# Altium schematic sheet IFAT6.SchDoc: IFAT6 PCB
size C; Revision: 1.0
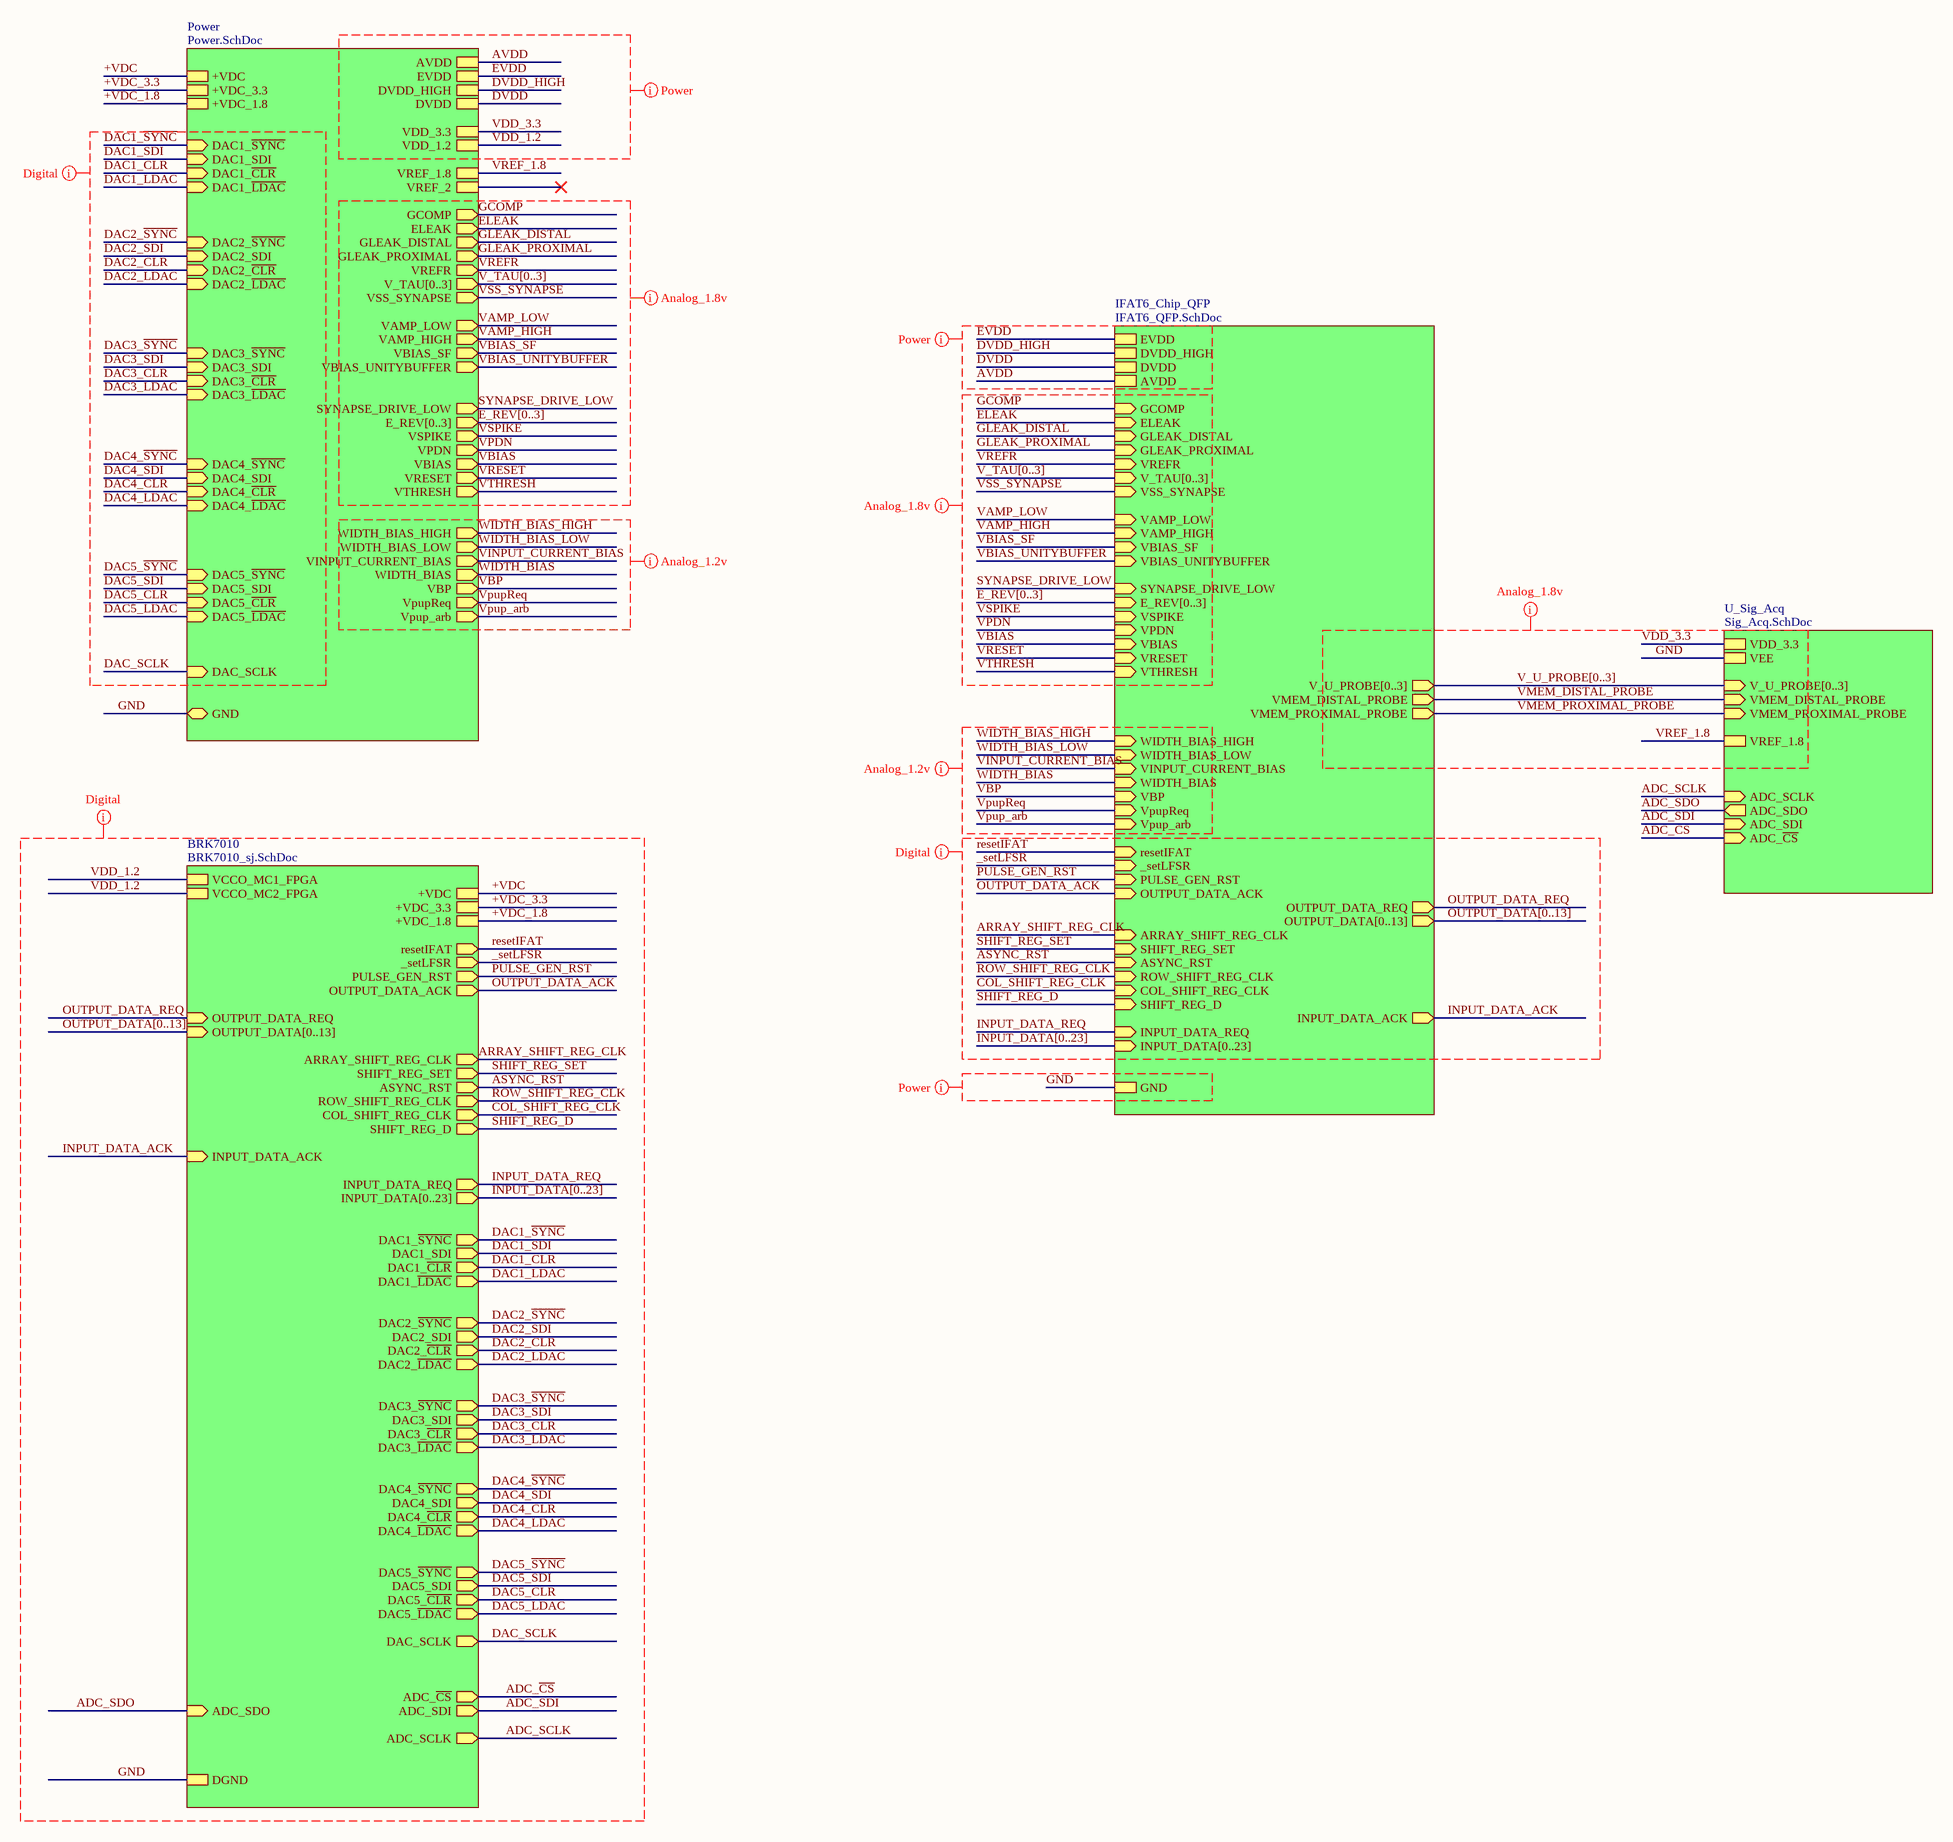
[diagram p0: IFAT6.SchDoc]

## Sub-sheets
BRK7010 = BRK7010_sj.SchDoc: VCCO_MC2_FPGA, DGND, +VDC, +VDC_3.3, INPUT_DATA[0..23] (out), OUTPUT_DATA[0..13] (in), resetIFAT (out), _setLFSR (out), PULSE_GEN_RST (out), OUTPUT_DATA_ACK (out), OUTPUT_DATA_REQ (in), ARRAY_SHIFT_REG_CLK (out), SHIFT_REG_SET (out), ASYNC_RST (out), ROW_SHIFT_REG_CLK (out), COL_SHIFT_REG_CLK (out), SHIFT_REG_D (out), INPUT_DATA_ACK (in), INPUT_DATA_REQ (out), +VDC_1.8, DAC1_~{SYNC} (out), DAC1_SDI (out), DAC1_~{CLR} (out), DAC1_~{LDAC} (out), DAC2_~{SYNC} (out), DAC2_SDI (out), DAC2_~{CLR} (out), DAC2_~{LDAC} (out), DAC3_~{SYNC} (out), DAC3_SDI (out), DAC3_~{CLR} (out), DAC3_~{LDAC} (out), DAC4_~{CLR} (out), DAC4_~{LDAC} (out), DAC4_~{SYNC} (out), DAC4_SDI (out), DAC_SCLK (out), DAC5_~{LDAC} (out), DAC5_SDI (out), DAC5_~{CLR} (out), DAC5_~{SYNC} (out), ADC_SCLK (out), ADC_SDI (out), ADC_SDO (in), ADC_~{CS} (out), VCCO_MC1_FPGA
IFAT6_Chip_QFP = IFAT6_QFP.SchDoc: GCOMP (in), GLEAK_PROXIMAL (in), PULSE_GEN_RST (in), GND, SHIFT_REG_SET (in), INPUT_DATA[0..23] (in), EVDD, E_REV[0..3] (in), VBIAS (in), ELEAK (in), VMEM_DISTAL_PROBE (out), VSPIKE (in), SYNAPSE_DRIVE_LOW (in), VTHRESH (in), _setLFSR (in), COL_SHIFT_REG_CLK (in), WIDTH_BIAS_HIGH (in), VAMP_LOW (in), V_TAU[0..3] (in), ROW_SHIFT_REG_CLK (in), VPDN (in), VREFR (in), AVDD, ARRAY_SHIFT_REG_CLK (in), OUTPUT_DATA_ACK (in), VRESET (in), WIDTH_BIAS_LOW (in), VAMP_HIGH (in), OUTPUT_DATA_REQ (out), V_U_PROBE[0..3] (out), ASYNC_RST (in), OUTPUT_DATA[0..13] (out), SHIFT_REG_D (in), DVDD_HIGH, VBIAS_UNITYBUFFER (in), INPUT_DATA_REQ (in), VBIAS_SF (in), INPUT_DATA_ACK (out), VMEM_PROXIMAL_PROBE (out), GLEAK_DISTAL (in), VSS_SYNAPSE (in), VBP (in), Vpup_arb (in), DVDD, WIDTH_BIAS (in), VpupReq (in), VINPUT_CURRENT_BIAS (in), resetIFAT (in)
Power = Power.SchDoc: DVDD_HIGH, +VDC, AVDD, EVDD, DAC1_~{SYNC} (in), DAC1_SDI (in), DAC1_~{CLR} (in), DAC1_~{LDAC} (in), DAC2_~{SYNC} (in), DAC2_SDI (in), DAC2_~{CLR} (in), DAC2_~{LDAC} (in), +VDC_3.3, +VDC_1.8, GND (bidir), DAC3_~{SYNC} (in), DAC3_SDI (in), DAC3_~{CLR} (in), DAC3_~{LDAC} (in), DAC4_~{CLR} (in), DAC4_~{LDAC} (in), DAC4_~{SYNC} (in), DAC4_SDI (in), DVDD, VDD_3.3, GCOMP (out), ELEAK (out), GLEAK_DISTAL (out), GLEAK_PROXIMAL (out), VREFR (out), V_TAU[0..3] (out), VSS_SYNAPSE (out), VAMP_LOW (out), VAMP_HIGH (out), VBIAS_SF (out), VBIAS_UNITYBUFFER (out), SYNAPSE_DRIVE_LOW (out), E_REV[0..3] (out), VSPIKE (out), VPDN (out), VBIAS (out), VRESET (out), VTHRESH (out), WIDTH_BIAS_HIGH (out), WIDTH_BIAS_LOW (out), VINPUT_CURRENT_BIAS (out), WIDTH_BIAS (out), VBP (out), VpupReq (out), Vpup_arb (out), DAC_SCLK (in), VREF_1.8, VREF_2, DAC5_~{LDAC} (in), DAC5_SDI (in), DAC5_~{CLR} (in), DAC5_~{SYNC} (in), VDD_1.2
U_Sig_Acq = Sig_Acq.SchDoc: VDD_3.3, VEE, VMEM_DISTAL_PROBE (in), VMEM_PROXIMAL_PROBE (in), V_U_PROBE[0..3] (in), ADC_SCLK (in), ADC_SDI (in), ADC_SDO (out), ADC_~{CS} (in), VREF_1.8

## Nets
+VDC: sheet Power/+VDC, sheet BRK7010/+VDC
+VDC_1.8: sheet Power/+VDC_1.8, sheet BRK7010/+VDC_1.8
+VDC_3.3: sheet Power/+VDC_3.3, sheet BRK7010/+VDC_3.3
_setLFSR: sheet IFAT6_Chip_QFP/_setLFSR, sheet BRK7010/_setLFSR
ADC_~{CS}: sheet U_Sig_Acq/ADC_~{CS}, sheet BRK7010/ADC_~{CS}
ADC_SCLK: sheet U_Sig_Acq/ADC_SCLK, sheet BRK7010/ADC_SCLK
ADC_SDI: sheet U_Sig_Acq/ADC_SDI, sheet BRK7010/ADC_SDI
ADC_SDO: sheet U_Sig_Acq/ADC_SDO, sheet BRK7010/ADC_SDO
ARRAY_SHIFT_REG_CLK: sheet IFAT6_Chip_QFP/ARRAY_SHIFT_REG_CLK, sheet BRK7010/ARRAY_SHIFT_REG_CLK
ASYNC_RST: sheet IFAT6_Chip_QFP/ASYNC_RST, sheet BRK7010/ASYNC_RST
AVDD: sheet IFAT6_Chip_QFP/AVDD, sheet Power/AVDD
COL_SHIFT_REG_CLK: sheet IFAT6_Chip_QFP/COL_SHIFT_REG_CLK, sheet BRK7010/COL_SHIFT_REG_CLK
DAC1_~{CLR}: sheet Power/DAC1_~{CLR}, sheet BRK7010/DAC1_~{CLR}
DAC1_~{LDAC}: sheet Power/DAC1_~{LDAC}, sheet BRK7010/DAC1_~{LDAC}
DAC1_~{SYNC}: sheet Power/DAC1_~{SYNC}, sheet BRK7010/DAC1_~{SYNC}
DAC1_SDI: sheet Power/DAC1_SDI, sheet BRK7010/DAC1_SDI
DAC2_~{CLR}: sheet Power/DAC2_~{CLR}, sheet BRK7010/DAC2_~{CLR}
DAC2_~{LDAC}: sheet Power/DAC2_~{LDAC}, sheet BRK7010/DAC2_~{LDAC}
DAC2_~{SYNC}: sheet Power/DAC2_~{SYNC}, sheet BRK7010/DAC2_~{SYNC}
DAC2_SDI: sheet Power/DAC2_SDI, sheet BRK7010/DAC2_SDI
DAC3_~{CLR}: sheet Power/DAC3_~{CLR}, sheet BRK7010/DAC3_~{CLR}
DAC3_~{LDAC}: sheet Power/DAC3_~{LDAC}, sheet BRK7010/DAC3_~{LDAC}
DAC3_~{SYNC}: sheet Power/DAC3_~{SYNC}, sheet BRK7010/DAC3_~{SYNC}
DAC3_SDI: sheet Power/DAC3_SDI, sheet BRK7010/DAC3_SDI
DAC4_~{CLR}: sheet Power/DAC4_~{CLR}, sheet BRK7010/DAC4_~{CLR}
DAC4_~{LDAC}: sheet Power/DAC4_~{LDAC}, sheet BRK7010/DAC4_~{LDAC}
DAC4_~{SYNC}: sheet Power/DAC4_~{SYNC}, sheet BRK7010/DAC4_~{SYNC}
DAC4_SDI: sheet Power/DAC4_SDI, sheet BRK7010/DAC4_SDI
DAC5_~{CLR}: sheet Power/DAC5_~{CLR}, sheet BRK7010/DAC5_~{CLR}
DAC5_~{LDAC}: sheet Power/DAC5_~{LDAC}, sheet BRK7010/DAC5_~{LDAC}
DAC5_~{SYNC}: sheet Power/DAC5_~{SYNC}, sheet BRK7010/DAC5_~{SYNC}
DAC5_SDI: sheet Power/DAC5_SDI, sheet BRK7010/DAC5_SDI
DAC_SCLK: sheet Power/DAC_SCLK, sheet BRK7010/DAC_SCLK
DVDD: sheet IFAT6_Chip_QFP/DVDD, sheet Power/DVDD
DVDD_HIGH: sheet IFAT6_Chip_QFP/DVDD_HIGH, sheet Power/DVDD_HIGH
ELEAK: sheet IFAT6_Chip_QFP/ELEAK, sheet Power/ELEAK
EVDD: sheet IFAT6_Chip_QFP/EVDD, sheet Power/EVDD
GCOMP: sheet IFAT6_Chip_QFP/GCOMP, sheet Power/GCOMP
GLEAK_DISTAL: sheet IFAT6_Chip_QFP/GLEAK_DISTAL, sheet Power/GLEAK_DISTAL
GLEAK_PROXIMAL: sheet IFAT6_Chip_QFP/GLEAK_PROXIMAL, sheet Power/GLEAK_PROXIMAL
GND: sheet IFAT6_Chip_QFP/GND, sheet Power/GND, sheet U_Sig_Acq/VEE, sheet BRK7010/DGND
INPUT_DATA_ACK: sheet IFAT6_Chip_QFP/INPUT_DATA_ACK, sheet BRK7010/INPUT_DATA_ACK
INPUT_DATA_REQ: sheet IFAT6_Chip_QFP/INPUT_DATA_REQ, sheet BRK7010/INPUT_DATA_REQ
OUTPUT_DATA_ACK: sheet IFAT6_Chip_QFP/OUTPUT_DATA_ACK, sheet BRK7010/OUTPUT_DATA_ACK
OUTPUT_DATA_REQ: sheet IFAT6_Chip_QFP/OUTPUT_DATA_REQ, sheet BRK7010/OUTPUT_DATA_REQ
PULSE_GEN_RST: sheet IFAT6_Chip_QFP/PULSE_GEN_RST, sheet BRK7010/PULSE_GEN_RST
resetIFAT: sheet IFAT6_Chip_QFP/resetIFAT, sheet BRK7010/resetIFAT
ROW_SHIFT_REG_CLK: sheet IFAT6_Chip_QFP/ROW_SHIFT_REG_CLK, sheet BRK7010/ROW_SHIFT_REG_CLK
SHIFT_REG_D: sheet IFAT6_Chip_QFP/SHIFT_REG_D, sheet BRK7010/SHIFT_REG_D
SHIFT_REG_SET: sheet IFAT6_Chip_QFP/SHIFT_REG_SET, sheet BRK7010/SHIFT_REG_SET
SYNAPSE_DRIVE_LOW: sheet IFAT6_Chip_QFP/SYNAPSE_DRIVE_LOW, sheet Power/SYNAPSE_DRIVE_LOW
VAMP_HIGH: sheet IFAT6_Chip_QFP/VAMP_HIGH, sheet Power/VAMP_HIGH
VAMP_LOW: sheet IFAT6_Chip_QFP/VAMP_LOW, sheet Power/VAMP_LOW
VBIAS: sheet IFAT6_Chip_QFP/VBIAS, sheet Power/VBIAS
VBIAS_SF: sheet IFAT6_Chip_QFP/VBIAS_SF, sheet Power/VBIAS_SF
VBIAS_UNITYBUFFER: sheet IFAT6_Chip_QFP/VBIAS_UNITYBUFFER, sheet Power/VBIAS_UNITYBUFFER
VBP: sheet IFAT6_Chip_QFP/VBP, sheet Power/VBP
VDD_1.2: sheet Power/VDD_1.2, sheet BRK7010/VCCO_MC2_FPGA, sheet BRK7010/VCCO_MC1_FPGA
VDD_3.3: sheet Power/VDD_3.3, sheet U_Sig_Acq/VDD_3.3
VINPUT_CURRENT_BIAS: sheet IFAT6_Chip_QFP/VINPUT_CURRENT_BIAS, sheet Power/VINPUT_CURRENT_BIAS
VMEM_DISTAL_PROBE: sheet IFAT6_Chip_QFP/VMEM_DISTAL_PROBE, sheet U_Sig_Acq/VMEM_DISTAL_PROBE
VMEM_PROXIMAL_PROBE: sheet IFAT6_Chip_QFP/VMEM_PROXIMAL_PROBE, sheet U_Sig_Acq/VMEM_PROXIMAL_PROBE
VPDN: sheet IFAT6_Chip_QFP/VPDN, sheet Power/VPDN
Vpup_arb: sheet IFAT6_Chip_QFP/Vpup_arb, sheet Power/Vpup_arb
VpupReq: sheet IFAT6_Chip_QFP/VpupReq, sheet Power/VpupReq
VREF_1.8: sheet Power/VREF_1.8, sheet U_Sig_Acq/VREF_1.8
VREFR: sheet IFAT6_Chip_QFP/VREFR, sheet Power/VREFR
VRESET: sheet IFAT6_Chip_QFP/VRESET, sheet Power/VRESET
VSPIKE: sheet IFAT6_Chip_QFP/VSPIKE, sheet Power/VSPIKE
VSS_SYNAPSE: sheet IFAT6_Chip_QFP/VSS_SYNAPSE, sheet Power/VSS_SYNAPSE
VTHRESH: sheet IFAT6_Chip_QFP/VTHRESH, sheet Power/VTHRESH
WIDTH_BIAS: sheet IFAT6_Chip_QFP/WIDTH_BIAS, sheet Power/WIDTH_BIAS
WIDTH_BIAS_HIGH: sheet IFAT6_Chip_QFP/WIDTH_BIAS_HIGH, sheet Power/WIDTH_BIAS_HIGH
WIDTH_BIAS_LOW: sheet IFAT6_Chip_QFP/WIDTH_BIAS_LOW, sheet Power/WIDTH_BIAS_LOW

## Buses and harness runs
bus E_REV[0..3] = sheet IFAT6_Chip_QFP/E_REV[0..3]
bus E_REV[0..3] = sheet Power/E_REV[0..3]
bus INPUT_DATA[0..23] = sheet BRK7010/INPUT_DATA[0..23]
bus INPUT_DATA[0..23] = sheet IFAT6_Chip_QFP/INPUT_DATA[0..23]
bus OUTPUT_DATA[0..13] = sheet BRK7010/OUTPUT_DATA[0..13]
bus OUTPUT_DATA[0..13] = sheet IFAT6_Chip_QFP/OUTPUT_DATA[0..13]
bus V_TAU[0..3] = sheet IFAT6_Chip_QFP/V_TAU[0..3]
bus V_TAU[0..3] = sheet Power/V_TAU[0..3]
bus V_U_PROBE[0..3] = sheet IFAT6_Chip_QFP/V_U_PROBE[0..3] = sheet U_Sig_Acq/V_U_PROBE[0..3]

## Layout directives
mark named Analog_1.8v: E_REV[0..3], ELEAK, GCOMP, GLEAK_DISTAL, GLEAK_PROXIMAL, GND, SYNAPSE_DRIVE_LOW, V_TAU[0..3], V_U_PROBE[0..3], VAMP_HIGH, VAMP_LOW, VBIAS, VBIAS_SF, VBIAS_UNITYBUFFER, VDD_3.3, VMEM_DISTAL_PROBE, VMEM_PROXIMAL_PROBE, VPDN, VREF_1.8, VREFR, VRESET, VSPIKE, VSS_SYNAPSE, VTHRESH
mark named Digital: +VDC, +VDC_1.8, +VDC_3.3, _setLFSR, ADC_SCLK, ADC_SDI, ADC_SDO, ADC_~{CS}, ARRAY_SHIFT_REG_CLK, ASYNC_RST, COL_SHIFT_REG_CLK, DAC1_SDI, DAC1_~{CLR}, DAC1_~{LDAC}, DAC1_~{SYNC}, DAC2_SDI, DAC2_~{CLR}, DAC2_~{LDAC}, DAC2_~{SYNC}, DAC3_SDI, DAC3_~{CLR}, DAC3_~{LDAC}, DAC3_~{SYNC}, DAC4_SDI, DAC4_~{CLR}, DAC4_~{LDAC}, DAC4_~{SYNC}, DAC5_SDI, DAC5_~{CLR}, DAC5_~{LDAC}, DAC5_~{SYNC}, DAC_SCLK, GND, INPUT_DATA[0..23], INPUT_DATA_ACK, INPUT_DATA_REQ, OUTPUT_DATA[0..13], OUTPUT_DATA_ACK, OUTPUT_DATA_REQ, PULSE_GEN_RST, resetIFAT, ROW_SHIFT_REG_CLK, SHIFT_REG_D, SHIFT_REG_SET, VDD_1.2
mark named Power: AVDD, DVDD, DVDD_HIGH, EVDD, GND, VDD_1.2, VDD_3.3
mark named Analog_1.2v: VBP, VINPUT_CURRENT_BIAS, Vpup_arb, VpupReq, WIDTH_BIAS, WIDTH_BIAS_HIGH, WIDTH_BIAS_LOW